# Altium schematic sheet WL-DAC904.SchDoc
size 594 x 420 mm; Address1: Address1; Address2: Address2; Address3: Address3; Address4: Address4; DocumentNumber: Wolf-Lite; SheetNumber: 5; Scale: 1:1; DocumentType: Схема электрическая принципиальная; FirstReferrence: UA3REO/R7KBI
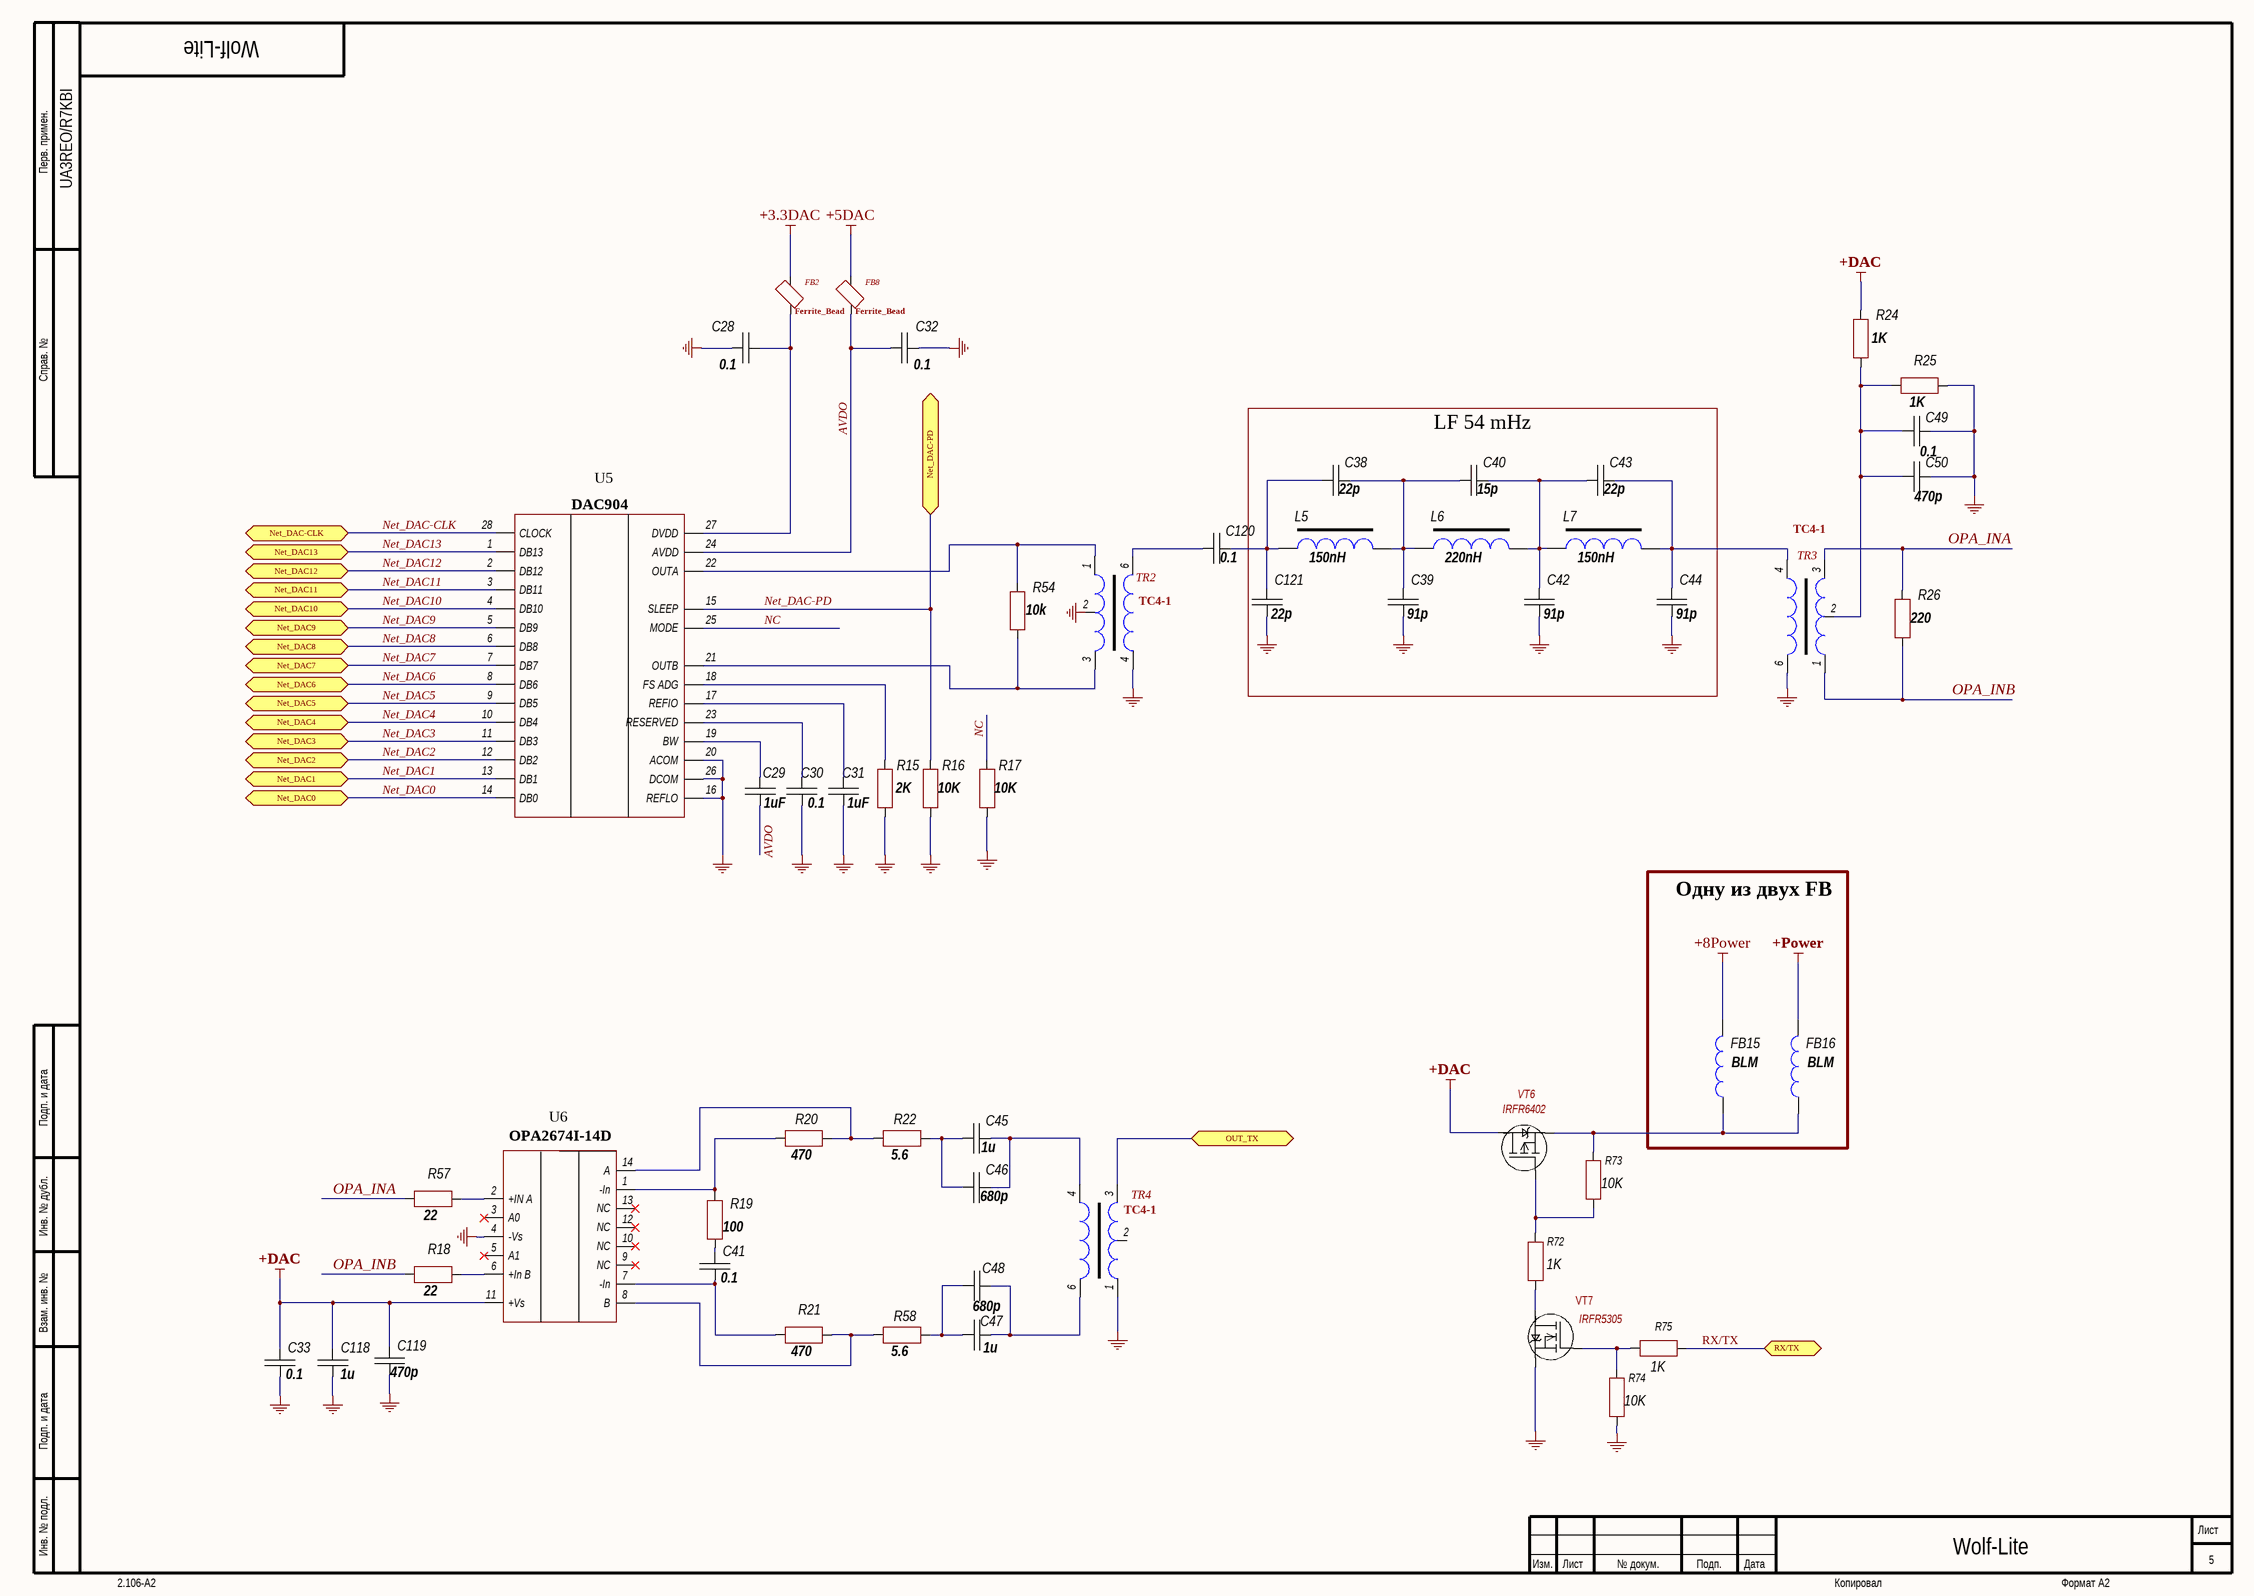
[diagram p0: WL-DAC904.SchDoc]

## Parts
C28  0.1  [CH0805C]
C29  1uF  [CH0805C]
C30  0.1  [CH0805C]
C31  1uF  [CH0805C]
C32  0.1  [CH0805C]
C33  0.1  [CH0805C]
C38  22p  [CH0805C]
C39  91p  [CH0805C]
C40  15p  [CH0805C]
C41  0.1  [CH0805C]
C42  91p  [CH0805C]
C43  22p  [CH0805C]
C44  91p  [CH0805C]
C45  1u  [CH0805C]
C46  680p  [CH0805C]
C47  1u  [CH0805C]
C48  680p  [CH0805C]
C49  0.1  [CH0805C]
C50  470p  [CH0805C]
C118  1u  [CH0805C]
C119  470p  [CH0805C]
C120  0.1  [CH0805C]
C121  22p  [CH0805C]
FB2  Ferrite_Bead  [CH0805L]
FB8  Ferrite_Bead  [CH0805L]
FB15  BLM  [CH0805L]
FB16  BLM  [CH0805L]
L5  150nH  [L1210]
L6  220nH  [L1210]
L7  150nH  [L1210]
R15  2K  [CH0805R]
R16  10K  [CH0805R]
R17  10K  [CH0805R]
R18  22  [CH0805R]
R19  100  [CH0805R]
R20  470  [CH0805R]
R21  470  [CH0805R]
R22  5.6  [CH0805R]
R24  1K  [CH0805R]
R25  1K  [CH0805R]
R26  220  [CH0805R]
R54  10k  [CH0805R]
R57  22  [CH0805R]
R58  5.6  [CH0805R]
R72  1K  [CH0805R]
R73  10K  [CH0805R]
R74  10K  [CH0805R]
R75  1K  [CH0805R]
TR2  TC4-1  [TC1-4]
TR3  TC4-1  [TC1-4]
TR4  TC4-1  [TC1-4]
U5  DAC904  [28-TSSOP]
U6  OPA2674I-14D  [14-SOIC]
VT6  IRFR6402  [SOT23_132]
VT7  IRFR5305  [SOT23_132]

## Blocks framed on the sheet
LF 54 mHz: C38-C40 C42-C44 C121 L5-L7
Одну из двух FB: FB15 FB16

## Ports
Net_DAC0 (bidir), Net_DAC1 (bidir), Net_DAC2 (bidir), Net_DAC3 (bidir), Net_DAC4 (bidir), Net_DAC5 (bidir), Net_DAC6 (bidir), Net_DAC7 (bidir), Net_DAC8 (bidir), Net_DAC9 (bidir), Net_DAC10 (bidir), Net_DAC11 (bidir), Net_DAC12 (bidir), Net_DAC13 (bidir), Net_DAC-CLK (bidir), Net_DAC-PD (bidir), OUT_TX (bidir), RX/TX (bidir)

## Nets
+3.3DAC: FB2.2
+5DAC: FB8.2
+8Power: FB15.1
+DAC: C33.1 C118.1 C119.1 R24.1 U6.11(+Vs) VT6.3(Сток(Drain))
+Power: FB16.1
GND: C28.2 C30.2 C31.2 C32.2 C33.2 C39.1 C42.1 C44.1 C49.1 C50.1 C118.2 C119.2 C121.1 R15.1 R16.1 R17.1 R25.2 R74.1 TR2.2 TR2.4 TR3.6 TR4.1 U5.16(REFLO) U5.20(ACOM) U5.26(DCOM) U6.4(-Vs) VT7.2(I)
AVDO: C29.2 C32.1 FB8.1 U5.24(AVDD)
NC: R17.2 U5.25(MODE)
Net_DAC0: U5.14(DB0) ; port Net_DAC0
Net_DAC1: U5.13(DB1) ; port Net_DAC1
Net_DAC2: U5.12(DB2) ; port Net_DAC2
Net_DAC3: U5.11(DB3) ; port Net_DAC3
Net_DAC4: U5.10(DB4) ; port Net_DAC4
Net_DAC5: U5.9(DB5) ; port Net_DAC5
Net_DAC6: U5.8(DB6) ; port Net_DAC6
Net_DAC7: U5.7(DB7) ; port Net_DAC7
Net_DAC8: U5.6(DB8) ; port Net_DAC8
Net_DAC9: U5.5(DB9) ; port Net_DAC9
Net_DAC10: U5.4(DB10) ; port Net_DAC10
Net_DAC11: U5.3(DB11) ; port Net_DAC11
Net_DAC12: U5.2(DB12) ; port Net_DAC12
Net_DAC13: U5.1(DB13) ; port Net_DAC13
Net_DAC-CLK: U5.28(CLOCK) ; port Net_DAC-CLK
Net_DAC-PD: R16.2 U5.15(SLEEP) ; port Net_DAC-PD
OPA_INA: R26.1 R57.1 TR3.3
OPA_INB: R18.1 R26.2 TR3.1
OUT_TX: TR4.3 ; port OUT_TX
RX/TX: R75.1 ; port RX/TX
NetC28_1: C28.1 FB2.1 U5.27(DVDD)
NetC29_1: C29.1 U5.19(BW)
NetC30_1: C30.1 U5.23(RESERVED)
NetC31_1: C31.1 U5.17(REFIO)
NetC38_1: C38.1 C120.2 C121.2 L5.1
NetC38_2: C38.2 C39.2 C40.1 L5.2 L6.1
NetC40_2: C40.2 C42.2 C43.1 L6.2 L7.1
NetC41_1: C41.1 R19.1
NetC41_2: C41.2 R21.1 U6.7(-In)
NetC43_2: C43.2 C44.2 L7.2 TR3.4
NetC45_1: C45.1 C46.1 R22.2
NetC45_2: C45.2 C46.2 TR4.4
NetC47_1: C47.1 C48.1 R58.2
NetC47_2: C47.2 C48.2 TR4.6
NetC49_2: C49.2 C50.2 R24.2 R25.1 TR3.2
NetC120_1: C120.1 TR2.6
NetFB15_2: FB15.2 FB16.2 R73.2 VT6.2(I)
NetR15_2: R15.2 U5.18(FS_ADG)
NetR18_2: R18.2 U6.6(+In_B)
NetR19_2: R19.2 R20.1 U6.1(-In)
NetR20_2: R20.2 R22.1 U6.14(A)
NetR21_2: R21.2 R58.1 U6.8(B)
NetR54_1: R54.1 TR2.1 U5.22(OUTA)
NetR54_2: R54.2 TR2.3 U5.21(OUTB)
NetR57_2: R57.2 U6.2(+IN_A)
NetR72_1: R72.1 VT7.3(Сток(Drain))
NetR72_2: R72.2 R73.1 VT6.1(Затвор(Gate))
NetR74_2: R74.2 R75.2 VT7.1(Затвор(Gate))

Not connected (* = marked no-connect by the designer): TR4 2; U6 3(A0)* 5(A1)* 9(NC)* 10(NC)* 12(NC)* 13(NC)*

## Notes on the sheet
- Перв. примен.
- Справ. №
- Подп. и дата
- Инв. № дубл.
- Взам. инв. №
- Инв. № подл.
- Изм.
- Лист
- № докум.
- Подп.
- Дата
- 2.106-A2
- Копировал
- Формат А2

## Library data of the parts
C28-C33 C38-C50 C118-C121 = Capacitor: Manufacturer: *; Model: *; HelpURL: *; ComponentKind: *; Value: *
FB2 FB8 = FB
FB15 FB16 = Inductor: Manufacturer: *; Model: *; HelpURL: *; ComponentKind: *; Value: *
L5-L7 = TRANS
R15-R22 R24-R26 R54 R57 R58 R72-R75 = Resistor: Manufacturer: *; Model: *; HelpURL: *; ComponentKind: *; Value: *
U6 = OPA2674
VT6 = P-KANAL
VT7 = N-KANAL